# Altium schematic sheet Arduino DUE.SchDoc: Soccer B Robot
size A3; SheetNumber: 2; SheetTotal: 3
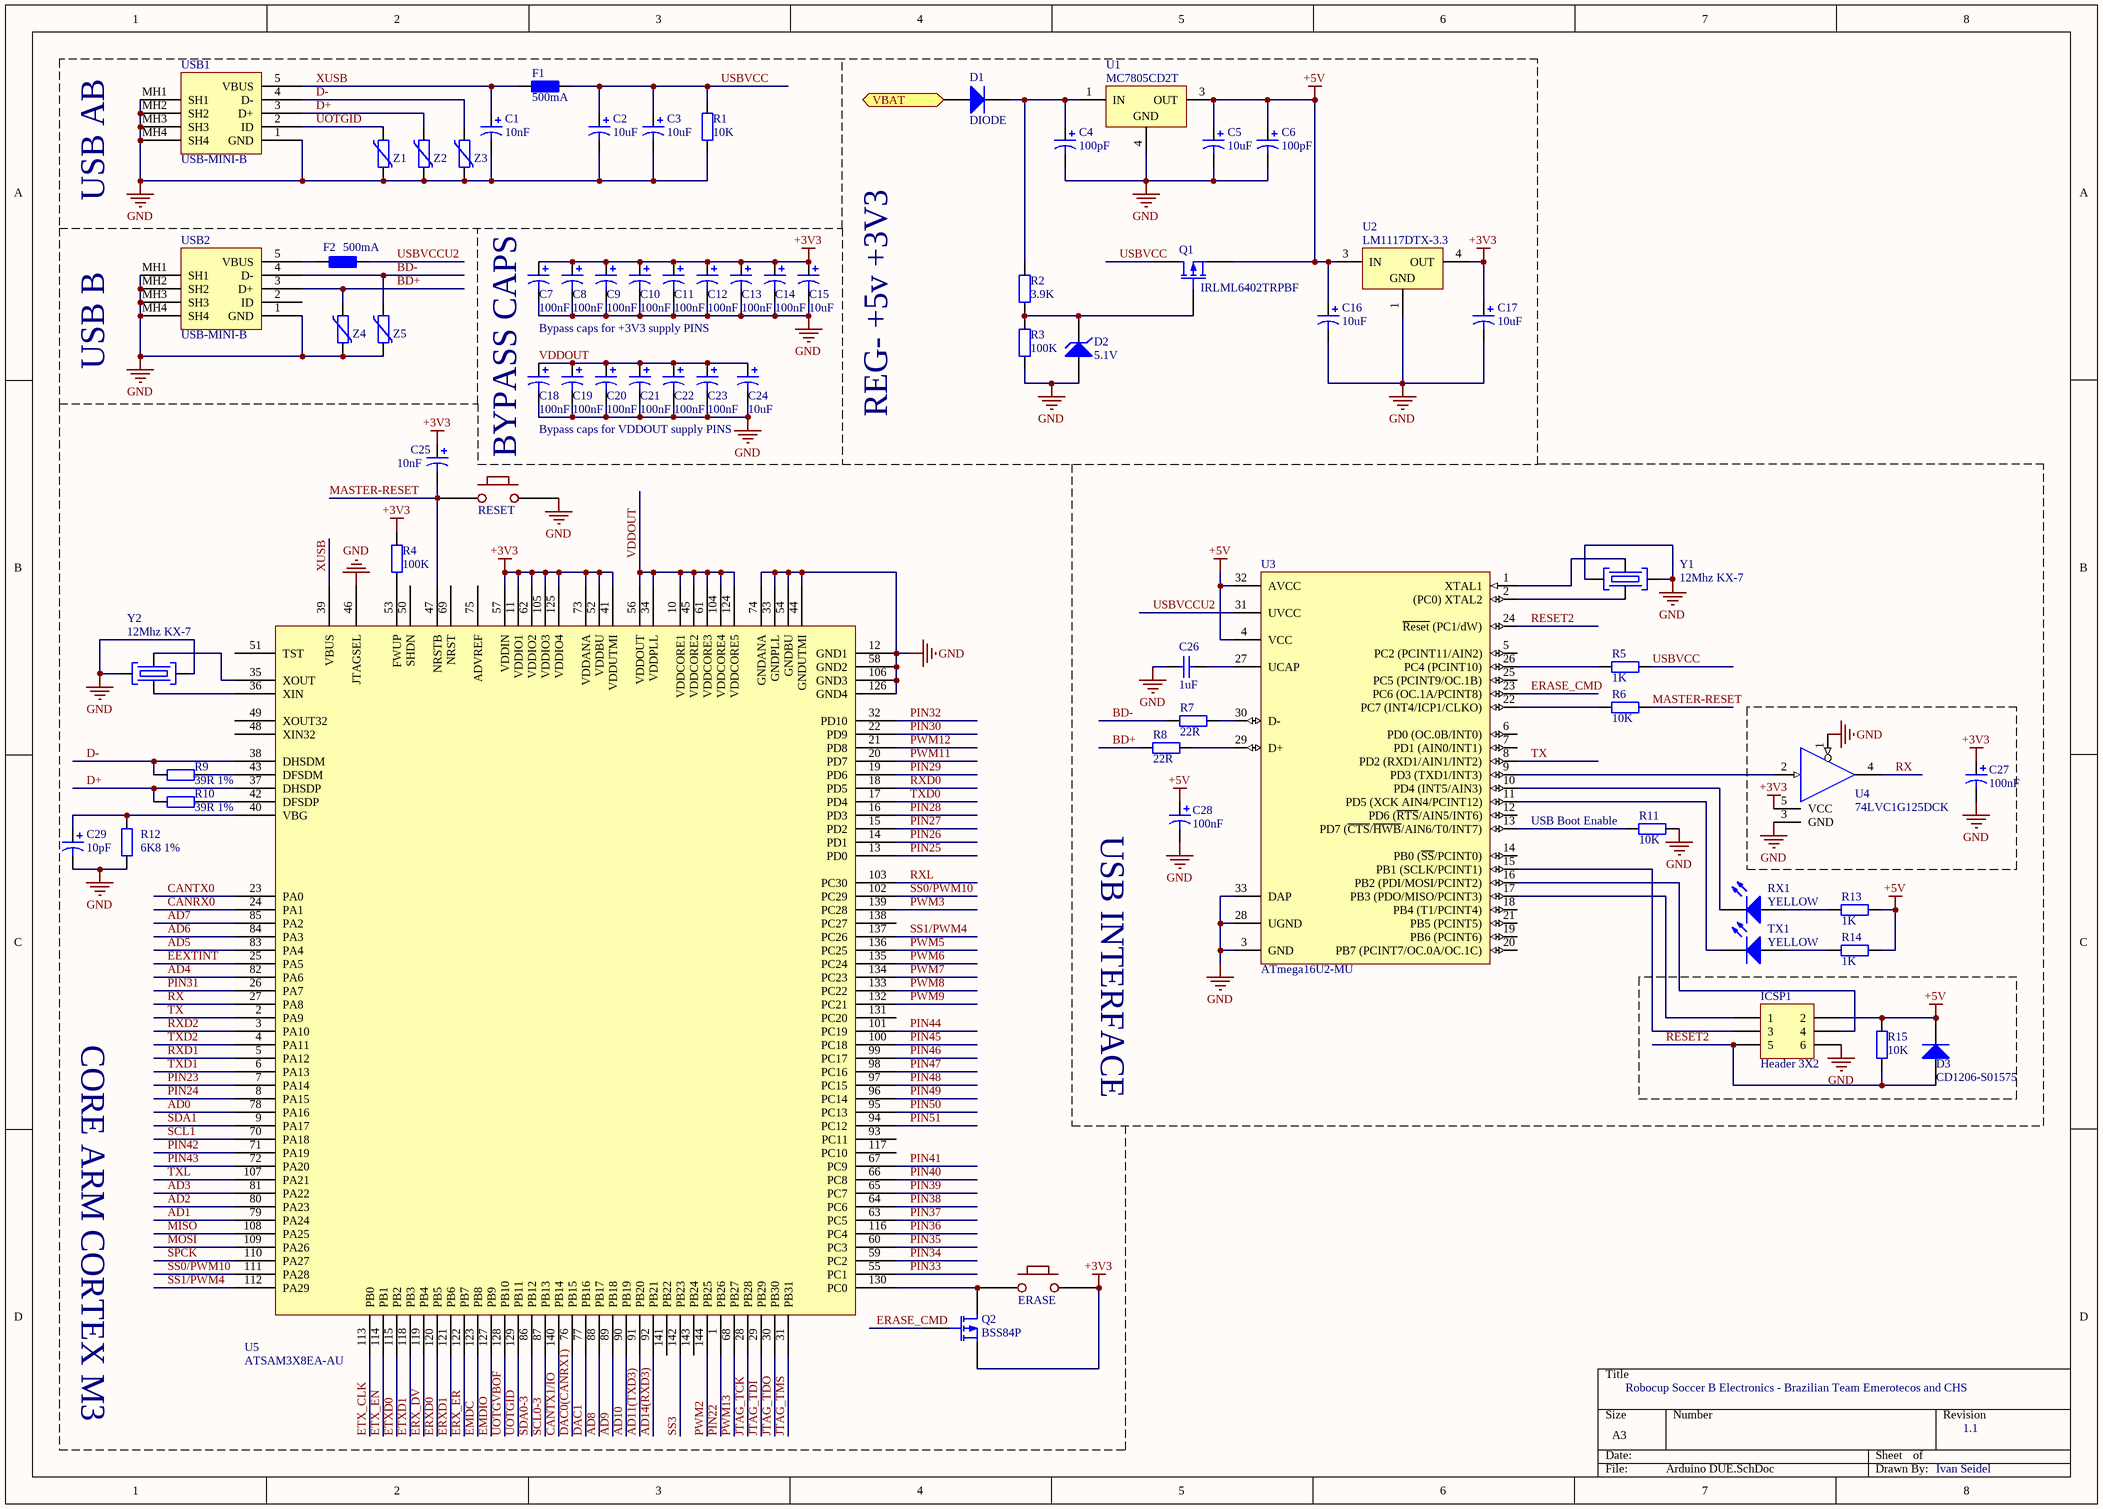
[diagram p0: Arduino DUE.SchDoc]

## Parts
C1  10nF  [C0805]
C2  10uF  [3528]
C3  10uF  [3528]
C4  100pF  [C0805]
C5  10uF  [3528]
C6  100pF  [C0805]
C7  100nF  [C0805]
C8  100nF  [C0805]
C9  100nF  [C0805]
C10  100nF  [C0805]
C11  100nF  [C0805]
C12  100nF  [C0805]
C13  100nF  [C0805]
C14  100nF  [C0805]
C15  10uF  [3528]
C16  10uF  [3528]
C17  10uF  [3528]
C18  100nF  [C0805]
C19  100nF  [C0805]
C20  100nF  [C0805]
C21  100nF  [C0805]
C22  100nF  [C0805]
C23  100nF  [C0805]
C24  10uF  [3528]
C25  10nF  [C0805]
C26  1uF  [0402]
C27  100nF  [C0805]
C28  100nF  [C0805]
C29  10pF  [C0805]
D1  DIODE  [DIODESMA]
D2  5.1V  [DIODE-SOD-123]
D3  CD1206-S01575  [DIODE1206]
ERASE  PUSH BUTTON  [PUSH-BUTTON 5,2X1,6MM]  (value not drawn)
F1  500mA  [MF-MSMF]
F2  500mA  [MF-MSMF]
ICSP1  Header 3X2  [HDR2X3]
Q1  IRLML6402TRPBF  [SOT-23]
Q2  BSS84P  [SOT-23]
R1  10K  [RES1206]
R2  3.9K  [RES1206]
R3  100K  [RES1206]
R4  100K  [RES1206]
R5  1K  [RES1206]
R6  10K  [RES1206]
R7  22R  [RES1206]
R8  22R  [RES1206]
R9  39R 1%  [RES1206]
R10  39R 1%  [RES1206]
R11  10K  [RES1206]
R12  6K8 1%  [RES1206]
R13  1K  [RES1206]
R14  1K  [RES1206]
R15  10K  [RES1206]
RESET  RESET  [PUSH-BUTTON 5,2X1,6MM]  (value not drawn)
RX1  YELLOW  [LED0805]
TX1  YELLOW  [LED0805]
U1  MC7805CD2T  [936-03]
U2  LM1117DTX-3.3  [TD03B_N]
U3  ATmega16U2-MU  [32PG_N]
U4  74LVC1G125DCK  [SC70-5]
U5  ATSAM3X8EA-AU  [LQFP144_M]
USB1  USB-MINI-B  [USB-MINI-B]
USB2  USB-MINI-B  [USB-MINI-B]
Y1  12Mhz KX-7  [OSC-4-PIN]
Y2  12Mhz KX-7  [OSC-4-PIN]
Z1  ESD  [ESD0603]  (value not drawn)
Z2  ESD  [ESD0603]  (value not drawn)
Z3  ESD  [ESD0603]  (value not drawn)
Z4  ESD  [ESD0603]  (value not drawn)
Z5  ESD  [ESD0603]  (value not drawn)

## Blocks framed on the sheet
USB AB: C1-C3 F1 R1 USB1 Z1-Z3

## Ports
VBAT (in)

## Nets
+3V3: C7.1 C8.1 C9.1 C10.1 C11.1 C12.1 C13.1 C14.1 C15.1 C17.1 C25.1 C27.1 ERASE.2 Q2.2(S) R4.2 U2.4(OUT) U4.5(VCC) U5.11(VDDIO1) U5.41(VDDUTMI) U5.52(VDDBU) U5.57(VDDIN) U5.62(VDDIO2) U5.73(VDDANA) U5.105(VDDIO3) U5.125(VDDIO4)
+5V: C5.1 C6.1 C16.1 C28.1 D3.1(K) ICSP1.2 Q1.2(S) R13.2 R14.2 R15.2 U1.3(OUT) U2.3(IN) U3.4(VCC) U3.32(AVCC)
GND: C1.2 C2.2 C3.2 C4.2 C5.2 C6.2 C7.2 C8.2 C9.2 C10.2 C11.2 C12.2 C13.2 C14.2 C15.2 C16.2 C17.2 C18.2 C19.2 C20.2 C21.2 C22.2 C23.2 C24.2 C26.1 C27.2 C28.2 C29.2 D2.2(A) ICSP1.6 R1.1 R3.1 R11.2 R12.1 RESET.2 U1.4(GND) U2.1(GND) U3.3(GND) U3.28(UGND) U3.33(DAP) U4.1 U4.3(GND) U5.12(GND1) U5.33(GNDPLL) U5.44(GNDUTMI) U5.46(JTAGSEL) U5.54(GNDBU) U5.58(GND2) U5.74(GNDANA) U5.106(GND3) U5.126(GND4) USB1.1(GND) USB1.MH1(SH1) USB1.MH2(SH2) USB1.MH3(SH3) USB1.MH4(SH4) USB2.1(GND) USB2.MH1(SH1) USB2.MH2(SH2) USB2.MH3(SH3) USB2.MH4(SH4) Y1.2 Y1.4 Y2.2 Y2.4 Z1.1 Z2.1 Z3.1 Z4.1 Z5.1
AD0: U5.78(PA16)
AD1: U5.79(PA24)
AD2: U5.80(PA23)
AD3: U5.81(PA22)
AD4: U5.82(PA6)
AD5: U5.83(PA4)
AD6: U5.84(PA3)
AD7: U5.85(PA2)
AD8: U5.88(PB17)
AD9: U5.89(PB18)
AD10: U5.90(PB19)
AD11(TXD3): U5.91(PB20)
AD14(RXD3): U5.92(PB21)
BD+: R8.1 USB2.3(D+) Z4.2
BD-: R7.1 USB2.4(D-) Z5.2
CANRX0: U5.24(PA1)
CANTX0: U5.23(PA0)
CANTX1/IO: U5.140(PB14)
D+: R10.2 U5.37(DHSDP) USB1.3(D+) Z2.2
D-: R9.2 U5.38(DHSDM) USB1.4(D-) Z3.2
DAC0(CANRX1): U5.76(PB15)
DAC1: U5.77(PB16)
EEXTINT: U5.25(PA5)
EMDC: U5.123(PB8)
EMDIO: U5.127(PB9)
ERASE_CMD: Q2.1(G) U3.23(PC6_(OC.1A/PCINT8))
ERX_DV: U5.119(PB4)
ERX_ER: U5.122(PB7)
ERXD0: U5.120(PB5)
ERXD1: U5.121(PB6)
ETX_CLK: U5.113(PB0)
ETX_EN: U5.114(PB1)
ETXD0: U5.115(PB2)
ETXD1: U5.118(PB3)
JTAG_TCK: U5.28(PB28)
JTAG_TDI: U5.29(PB29)
JTAG_TDO: U5.30(PB30)
JTAG_TMS: U5.31(PB31)
MASTER-RESET: C25.2 R6.2 RESET.1 U5.47(NRSTB)
MISO: U5.108(PA25)
MOSI: U5.109(PA26)
PIN22: U5.1(PB26)
PIN23: U5.7(PA14)
PIN24: U5.8(PA15)
PIN25: U5.13(PD0)
PIN26: U5.14(PD1)
PIN27: U5.15(PD2)
PIN28: U5.16(PD3)
PIN29: U5.19(PD6)
PIN30: U5.22(PD9)
PIN31: U5.26(PA7)
PIN32: U5.32(PD10)
PIN33: U5.55(PC1)
PIN34: U5.59(PC2)
PIN35: U5.60(PC3)
PIN36: U5.116(PC4)
PIN37: U5.63(PC5)
PIN38: U5.64(PC6)
PIN39: U5.65(PC7)
PIN40: U5.66(PC8)
PIN41: U5.67(PC9)
PIN42: U5.71(PA19)
PIN43: U5.72(PA20)
PIN44: U5.101(PC19)
PIN45: U5.100(PC18)
PIN46: U5.99(PC17)
PIN47: U5.98(PC16)
PIN48: U5.97(PC15)
PIN49: U5.96(PC14)
PIN50: U5.95(PC13)
PIN51: U5.94(PC12)
PWM2: U5.144(PB25)
PWM3: U5.139(PC28)
PWM5: U5.136(PC25)
PWM6: U5.135(PC24)
PWM7: U5.134(PC23)
PWM8: U5.133(PC22)
PWM9: U5.132(PC21)
PWM11: U5.20(PD7)
PWM12: U5.21(PD8)
PWM13: U5.68(PB27)
RESET2: D3.2(A) ICSP1.5 R15.1 U3.24(~{Reset}_(PC1/dW))
RX: U4.4 U5.27(PA8)
RXD0: U5.18(PD5)
RXD1: U5.5(PA12)
RXD2: U5.3(PA10)
RXL: U5.103(PC30)
SCL0-3: U5.87(PB13)
SCL1: U5.70(PA18)
SDA0-3: U5.86(PB12)
SDA1: U5.9(PA17)
SPCK: U5.110(PA27)
SS0/PWM10: U5.102(PC29) U5.111(PA28)
SS1/PWM4: U5.112(PA29) U5.137(PC26)
SS3: U5.142(PB23)
TX: U3.8(PD2_(RXD1/AIN1/INT2)) U5.2(PA9)
TXD0: U5.17(PD4)
TXD1: U5.6(PA13)
TXD2: U5.4(PA11)
TXL: U5.107(PA21)
UOTGID: U5.129(PB11) USB1.2(ID) Z1.2
UOTGVBOF: U5.128(PB10)
USBVCC: C2.1 C3.1 F1.2 Q1.3(D) R1.2 R5.2
USBVCCU2: F2.2 U3.31(UVCC)
VBAT: D1.2(A) ; port VBAT
VDDOUT: C18.1 C19.1 C20.1 C21.1 C22.1 C23.1 C24.1 U5.10(VDDCORE1) U5.34(VDDPLL) U5.45(VDDCORE2) U5.56(VDDOUT) U5.61(VDDCORE3) U5.104(VDDCORE4) U5.124(VDDCORE5)
XUSB: C1.1 F1.1 U5.39(VBUS) USB1.5(VBUS)
NetC4_1: C4.1 D1.1(K) R2.2 U1.1(IN)
NetC26_2: C26.2 U3.27(UCAP)
NetC29_1: C29.1 R12.2 U5.40(VBG)
NetD2_1: D2.1(K) Q1.1(G) R2.1 R3.2
NetERASE_1: ERASE.1 Q2.3(D) U5.130(PC0)
NetF2_1: F2.1 USB2.5(VBUS)
NetICSP1_1: ICSP1.1 U3.17(PB3_(PDO/MISO/PCINT3))
NetICSP1_3: ICSP1.3 U3.15(PB1_(SCLK/PCINT1))
NetICSP1_4: ICSP1.4 U3.16(PB2_(PDI/MOSI/PCINT2))
NetR4_1: R4.1 U5.53(FWUP)
NetR5_1: R5.1 U3.26(PC4_(PCINT10))
NetR6_1: R6.1 U3.22(PC7_(INT4/ICP1/CLKO))
NetR7_2: R7.2 U3.30(D-)
NetR8_2: R8.2 U3.29(D+)
NetR9_1: R9.1 U5.43(DFSDM)
NetR10_1: R10.1 U5.42(DFSDP)
NetR11_1: R11.1 U3.13(PD7_(~{CTS}/~{HWB}/AIN6/T0/INT7))
NetR13_1: R13.1 RX1.1(A)
NetR14_1: R14.1 TX1.1(A)
NetRX1_2: RX1.2(K) U3.10(PD4_(INT5/AIN3))
NetTX1_2: TX1.2(K) U3.11(PD5_(XCK_AIN4/PCINT12))
NetU3_1: U3.1(XTAL1) Y1.1
NetU3_2: U3.2((PC0)_XTAL2) Y1.3
NetU3_9: U3.9(PD3_(TXD1/INT3)) U4.2
NetU5_35: U5.35(XOUT) Y2.1
NetU5_36: U5.36(XIN) Y2.3

Not connected (* = marked no-connect by the designer): U3 5(PC2_(PCINT11/AIN2)) 6(PD0_(OC.0B/INT0)) 7(PD1_(AIN0/INT1)) 12(PD6_(~{RTS}/AIN5/INT6)) 14(PB0_(~{SS}/PCINT0)) 18(PB4_(T1/PCINT4)) 19(PB6_(PCINT6)) 20(PB7_(PCINT7/OC.0A/OC.1C)) 21(PB5_(PCINT5)) 25(PC5_(PCINT9/OC.1B)); U5 48(XIN32) 49(XOUT32) 50(SHDN) 51(TST) 69(NRST) 75(ADVREF) 93(PC11) 117(PC10) 131(PC20) 138(PC27) 141(PB22) 143(PB24); USB2 2(ID)

## Notes on the sheet
- USB B
- Bypass caps for +3V3 supply PINS
- BYPASS CAPS
- Bypass caps for VDDOUT supply PINS
- (near C15) REG- +5v +3V3
- (near C28) USB INTERFACE
- (near R11) USB Boot Enable
- CORE ARM CORTEX M3
- Robocup Soccer B Electronics - Brazilian Team Emerotecos and CHS
- 1.1
- Ivan Seidel

## Library data of the parts
C1 C25 = Cap Pol3: Polarized Capacitor (Surface Mount); Published: 8-Jun-2000; LatestRevisionDate: 29-May-2009; LatestRevisionNote: IPC-7351 Footprint Added.; PackageReference: C0805; Publisher: Altium Limited; PackageDescription: Chip Capacitor; Value: 10nF
C2 C3 C5 C15-C17 C24 = Cap Pol3: Polarized Capacitor (Surface Mount); Value: 10nF; Published: 8-Jun-2000; LatestRevisionDate: 29-May-2009; LatestRevisionNote: IPC-7351 Footprint Added.; PackageReference: C0805; Publisher: Altium Limited; PackageDescription: Chip Capacitor
C4 C6 C29 = Cap Pol3: Polarized Capacitor (Surface Mount); Value: 10nF; Fornecedor: Farnell; Published: 8-Jun-2000; LatestRevisionDate: 29-May-2009; LatestRevisionNote: IPC-7351 Footprint Added.; PackageReference: C0805; Publisher: Altium Limited; PackageDescription: Chip Capacitor
C7-C14 C18-C23 C27 C28 = Cap Pol3: Polarized Capacitor (Surface Mount); Value: 100pF; Published: 8-Jun-2000; LatestRevisionDate: 29-May-2009; LatestRevisionNote: IPC-7351 Footprint Added.; PackageReference: C0805; Publisher: Altium Limited; PackageDescription: Chip Capacitor
C26 = Cap Semi: Capacitor (Semiconductor SIM Model); Published: 8-Jun-2000; LatestRevisionDate: 29-May-2009; LatestRevisionNote: IPC-7351 Footprint Added.; PackageReference: C1206; Publisher: Altium Limited; PackageDescription: Chip Capacitor; Value: 1uF
D2 = ZENER: ZENER DIODE
D3 = DIODE
F1 F2 = MF-MSMF: MF-MSMF Series - PTC Resettable Fuses
ICSP1 = Header 3X2: Header, 3-Pin, Dual row; LatestRevisionDate: 17-Jul-2002; LatestRevisionNote: Re-released for DXP Platform.; Publisher: Altium Limited
Q1 Q2 = MOSFET-P: P-Channel MOSFET; Published: 8-Jun-2000; LatestRevisionDate: 17-Jul-2002; LatestRevisionNote: Re-released for DXP Platform.; PackageVersion: 1995/1996; PackageReference: E3; Publisher: Altium Limited; PackageDescription: TO, Flat Index; 3 In-Line, Axial Leads; Body Dia. 4.6mm; Lead Dia. 0.5 mm (max)
R1-R11 R13-R15 = RES
R12 = RES: Fornecedor: Farnell
RESET = PUSH BUTTON
RX1 TX1 = LED
U1 = MC7805CD2T: Three-Terminal Positive Voltage Regulator; Note: Pin 2 is electrically connected to Pin 4; Pin 2 is trimmed and not drawn;; Published: 15-Apr-2002; DatasheetVersion: 1997; PackageVersion: 1997; PackageReference: 936-03; Publisher: Altium Limited; PackageDescription: D2-PAK/TO-263-AB; 3 Leads (1 Cropped); Body 14.7 (inc. leads) x 10.2 mm (LxW max); ComponentLink1Description: Manufacturer Link; ComponentLink1URL: http://www.onsemi.com/site/products/taxonomy/0,4438,503,00.html; ComponentLink2Description: Datasheet; ComponentLink2URL: http://www.onsemi.com/pub/Collateral/MC7800-D.PDF
U2 = LM1117DTX-3.3: 800mA Low-Dropout Linear Regulator, 3-pin TO-252; Manufacturer: National Semiconductor; PackageTopMarking: NSUZXYTT*LM1117*DT-3.3; PowerWise: N; CompType: LDO IC; Published: 1-Mar-2010; DatasheetVersion: Apr-2006; PackageVersion: revD, Feb-2009; PackageReference: TD03B; Publisher: Altium Limited; PackageDescription: TO252, Molded, Jedec, 6.8 x 6.10 x 2.30mm Body, 3 Lead, 2.28mm Pitch, Surface Mount; PartNumber: LM1117DTX-3.3; RoHS: N; PinCount: 3; Code_JEDEC: TO-252-AA; ComponentLink1Description: LM1117 Datasheet; ComponentLink1URL: http://www.national.com/ds/LM/LM1117.pdf; ComponentLink2Description: LM1117 Web Page; ComponentLink2URL: http://www.national.com/pf/LM/LM1117.html; ComponentLink3Description: TD03B Package Page; ComponentLink3URL: http://www.national.com/packaging/folders/td03b.html
U3 = ATmega16U2-MU: 8-bit AVR Microcontroller, 2.7-5.5V, 16KB Flash, 512 Bytes EEPROM, 512 Bytes SRAM, 32-pin VQFN, Industrial Grade (-40°C to 85°C); Published: 1-Apr-2010; DatasheetVersion: revC, Dec-2009; PackageVersion: revA, Oct-2008; PackageReference: 32PG; Publisher: Altium Limited; PackageDescription: 32-Pin Quad Flat No-Lead (QFN) Sawn,  5 x 5 x 1.0 mm Body, Pitch 0.50 mm, 3.60mm Exposed Pad; Supplier 1: Digi-Key; Supplier Part Number 1: ATMEGA16U2-MU-ND; Supplier 2: Mouser; Supplier Part Number 2: 556-ATMEGA16U2-MU; Code_JEDEC: MO-220WHHD-2; ComponentLink1Description: Manufacturer Link; ComponentLink1URL: http://www.atmel.com/products/avr/default.asp?; ComponentLink2Description: ATmega8U2/16U2/32U2 Datasheet; ComponentLink2URL: http://www.atmel.com/dyn/resources/prod_documents/doc7799.pdf; ComponentLink3Description: ATmega8U2/16U2/32U2 Summary; ComponentLink3URL: http://www.atmel.com/dyn/resources/prod_documents/7799S.pdf; ComponentLink4Description: Atmel.com Home; ComponentLink4URL: http://www.atmel.com
U5 = ATSAM3X8E: ATSAM3X8EA-AU ARM CORTEX M3 Microcontroller
USB1 USB2 = USB-MINI-B: USB Mini type B Horizontal SMD
Y1 Y2 = OSC-4-PIN: KX-7 12MHz Oscilator 20pF
Z1-Z5 = ESD: ESD Protection Diode